# Altium schematic sheet DM3390_CAM_FFC_MIPI_2LANE.SchDoc: =project_title
size Tabloid; PageSetup: Record=PageOptions|CenterHorizontal=True|CenterVertical=True|PrintScale=0.73|XCorrection=1.00|YCorrection=1.00|PrintKind=0|BorderSize=5000000|LeftOffset=0|BottomOffset=0|Orientation=2|PaperLength=1000|PaperWidth=1000|Scale=100|PaperSource=7|PrintQuality=-4|MediaType=1|DitherType=10|PaperKind=A4|PrintScaleMode=1; CompanyName: Luxonis Holding; Organization: Luxonis Holding; Address1: 1925 Harmony Park Drive; Address2: Westminster, CO; Address3: 80234; Address4: United States; SheetNumber: 4; SheetTotal: 12
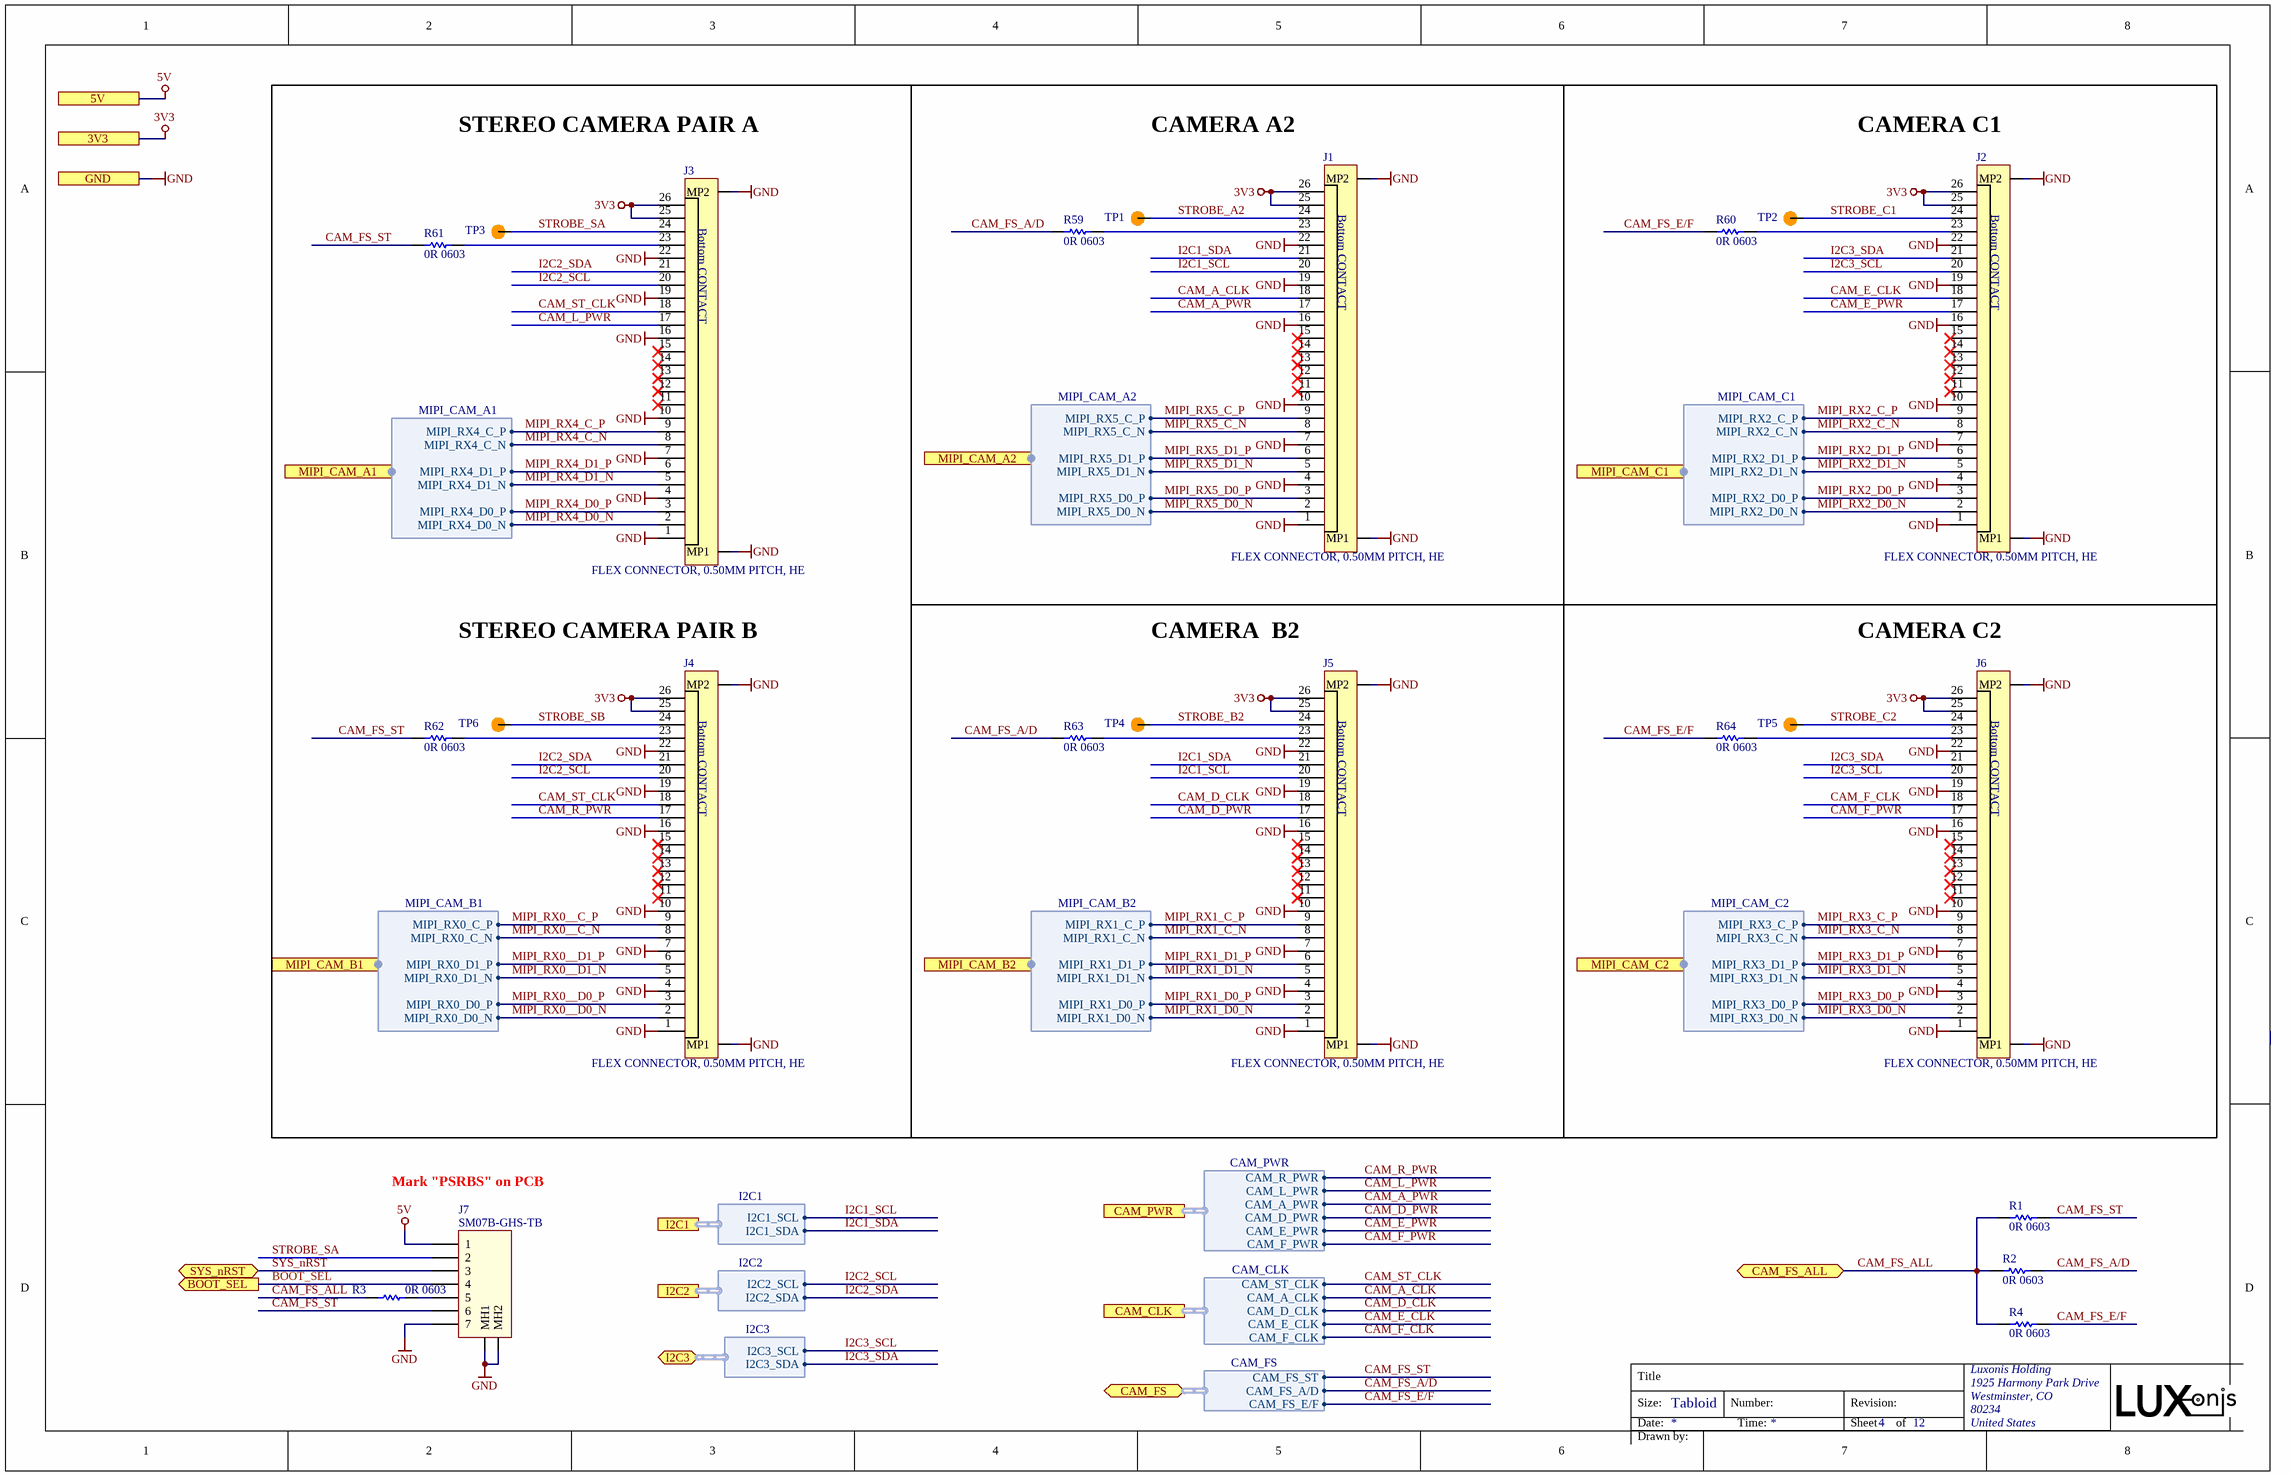
[diagram p0: DM3390_CAM_FFC_MIPI_2LANE.SchDoc]

## Parts
J1  FLEX CONNECTOR, 0.50MM PITCH, HE  [F32R-1A7H1-11026]
J2  FLEX CONNECTOR, 0.50MM PITCH, HE  [F32R-1A7H1-11026]
J3  FLEX CONNECTOR, 0.50MM PITCH, HE  [F32R-1A7H1-11026]
J4  FLEX CONNECTOR, 0.50MM PITCH, HE  [F32R-1A7H1-11026]
J5  FLEX CONNECTOR, 0.50MM PITCH, HE  [F32R-1A7H1-11026]
J6  FLEX CONNECTOR, 0.50MM PITCH, HE  [F32R-1A7H1-11026]
J7  SM07B-GHS-TB  [SM07B-GHS-TB]
R1  0R 0603  [RESC0603(1608)_N]
R2  0R 0603  [RESC0603(1608)_N]
R3  0R 0603  [RESC0603(1608)_N]
R4  0R 0603  [RESC0603(1608)_N]
R59  0R 0603  [RESC0603(1608)_N]
R60  0R 0603  [RESC0603(1608)_N]
R61  0R 0603  [RESC0603(1608)_N]
R62  0R 0603  [RESC0603(1608)_N]
R63  0R 0603  [RESC0603(1608)_N]
R64  0R 0603  [RESC0603(1608)_N]
TP1  TP100_200_NS  [TP100_200_NS]  (value not drawn)  (no BOM)
TP2  TP100_200_NS  [TP100_200_NS]  (value not drawn)  (no BOM)
TP3  TP100_200_NS  [TP100_200_NS]  (value not drawn)  (no BOM)
TP4  TP100_200_NS  [TP100_200_NS]  (value not drawn)  (no BOM)
TP5  TP100_200_NS  [TP100_200_NS]  (value not drawn)  (no BOM)
TP6  TP100_200_NS  [TP100_200_NS]  (value not drawn)  (no BOM)

## Blocks framed on the sheet
CAMERA A2: J1 R59 TP1
CAMERA C1: J2 R60 TP2
CAMERA  B2: J5 R63 TP4
CAMERA C2: J6 R64 TP5

## Ports
3V3, 5V, BOOT_SEL (out), CAM_CLK (harness CAM_CLK), CAM_FS (bidir, harness CAM_FS), CAM_FS_ALL (bidir), CAM_PWR (harness CAM_PWR), GND, I2C1 (harness I2C1), I2C2 (harness I2C2), I2C3 (bidir, harness I2C3), MIPI_CAM_A1 (harness MIPI_CAM_A1), MIPI_CAM_A2 (harness MIPI_CAM_A2), MIPI_CAM_B1 (harness MIPI_CAM_B1), MIPI_CAM_B2 (harness MIPI_CAM_B2), MIPI_CAM_C1 (harness MIPI_CAM_C1), MIPI_CAM_C2 (harness MIPI_CAM_C2), SYS_nRST (bidir)

## Harnesses
MIPI_CAM_C1: MIPI_RX2_D0_P, MIPI_RX2_D0_N, MIPI_RX2_D1_P, MIPI_RX2_D1_N, MIPI_RX2_C_P, MIPI_RX2_C_N
MIPI_CAM_C2: MIPI_RX3_C_P, MIPI_RX3_C_N, MIPI_RX3_D0_N, MIPI_RX3_D0_P, MIPI_RX3_D1_P, MIPI_RX3_D1_N
MIPI_CAM_B2: MIPI_RX1_D1_P, MIPI_RX1_D1_N, MIPI_RX1_C_P, MIPI_RX1_C_N, MIPI_RX1_D0_P, MIPI_RX1_D0_N
MIPI_CAM_B1: MIPI_RX0_D1_P, MIPI_RX0_D1_N, MIPI_RX0_C_P, MIPI_RX0_C_N, MIPI_RX0_D0_P, MIPI_RX0_D0_N
MIPI_CAM_A1: MIPI_RX4_D1_P, MIPI_RX4_D1_N, MIPI_RX4_C_P, MIPI_RX4_C_N, MIPI_RX4_D0_P, MIPI_RX4_D0_N
MIPI_CAM_A2: MIPI_RX5_D1_P, MIPI_RX5_D1_N, MIPI_RX5_C_P, MIPI_RX5_C_N, MIPI_RX5_D0_P, MIPI_RX5_D0_N
CAM_PWR: CAM_R_PWR, CAM_L_PWR, CAM_A_PWR, CAM_D_PWR, CAM_E_PWR, CAM_F_PWR
CAM_CLK: CAM_ST_CLK, CAM_A_CLK, CAM_D_CLK, CAM_E_CLK, CAM_F_CLK
CAM_FS: CAM_FS_ST, CAM_FS_A/D, CAM_FS_E/F
I2C3: I2C3_SCL, I2C3_SDA
I2C2: I2C2_SDA, I2C2_SCL
I2C1: I2C1_SDA, I2C1_SCL

## Nets
3V3: J1.25 J1.26 J2.25 J2.26 J3.25 J3.26 J4.25 J4.26 J5.25 J5.26 J6.25 J6.26 ; port 3V3
5V: J7.1 ; port 5V
GND: J1.1 J1.4 J1.7 J1.10 J1.16 J1.19 J1.22 J1.MP1 J1.MP2 J2.1 J2.4 J2.7 J2.10 J2.16 J2.19 J2.22 J2.MP1 J2.MP2 J3.1 J3.4 J3.7 J3.10 J3.16 J3.19 J3.22 J3.MP1 J3.MP2 J4.1 J4.4 J4.7 J4.10 J4.16 J4.19 J4.22 J4.MP1 J4.MP2 J5.1 J5.4 J5.7 J5.10 J5.16 J5.19 J5.22 J5.MP1 J5.MP2 J6.1 J6.4 J6.7 J6.10 J6.16 J6.19 J6.22 J6.MP1 J6.MP2 J7.7 J7.MH1 J7.MH2 ; port GND
BOOT_SEL: J7.4 ; port BOOT_SEL
CAM_A_CLK: J1.18 ; port CAM_CLK.CAM_A_CLK
CAM_A_PWR: J1.17 ; port CAM_PWR.CAM_A_PWR
CAM_D_CLK: J5.18 ; port CAM_CLK.CAM_D_CLK
CAM_D_PWR: J5.17 ; port CAM_PWR.CAM_D_PWR
CAM_E_CLK: J2.18 ; port CAM_CLK.CAM_E_CLK
CAM_E_PWR: J2.17 ; port CAM_PWR.CAM_E_PWR
CAM_F_CLK: J6.18 ; port CAM_CLK.CAM_F_CLK
CAM_F_PWR: J6.17 ; port CAM_PWR.CAM_F_PWR
CAM_FS_A/D: R2.2 R59.1 R63.1 ; port CAM_FS.CAM_FS_A/D
CAM_FS_ALL: R1.1 R2.1 R3.1 R4.1 ; port CAM_FS_ALL
CAM_FS_E/F: R4.2 R60.1 R64.1 ; port CAM_FS.CAM_FS_E/F
CAM_FS_ST: J7.6 R1.2 R61.1 R62.1 ; port CAM_FS.CAM_FS_ST
CAM_L_PWR: J3.17 ; port CAM_PWR.CAM_L_PWR
CAM_R_PWR: J4.17 ; port CAM_PWR.CAM_R_PWR
CAM_ST_CLK: J3.18 J4.18 ; port CAM_CLK.CAM_ST_CLK
I2C1_SCL: J1.20 J5.20 ; port I2C1.I2C1_SCL
I2C1_SDA: J1.21 J5.21 ; port I2C1.I2C1_SDA
I2C2_SCL: J3.20 J4.20 ; port I2C2.I2C2_SCL
I2C2_SDA: J3.21 J4.21 ; port I2C2.I2C2_SDA
I2C3_SCL: J2.20 J6.20 ; port I2C3.I2C3_SCL
I2C3_SDA: J2.21 J6.21 ; port I2C3.I2C3_SDA
MIPI_RX0__C_N: J4.8 ; port MIPI_CAM_B1.MIPI_RX0_C_N
MIPI_RX0__C_P: J4.9 ; port MIPI_CAM_B1.MIPI_RX0_C_P
MIPI_RX0__D0_N: J4.2 ; port MIPI_CAM_B1.MIPI_RX0_D0_N
MIPI_RX0__D0_P: J4.3 ; port MIPI_CAM_B1.MIPI_RX0_D0_P
MIPI_RX0__D1_N: J4.5 ; port MIPI_CAM_B1.MIPI_RX0_D1_N
MIPI_RX0__D1_P: J4.6 ; port MIPI_CAM_B1.MIPI_RX0_D1_P
MIPI_RX1_C_N: J5.8 ; port MIPI_CAM_B2.MIPI_RX1_C_N
MIPI_RX1_C_P: J5.9 ; port MIPI_CAM_B2.MIPI_RX1_C_P
MIPI_RX1_D0_N: J5.2 ; port MIPI_CAM_B2.MIPI_RX1_D0_N
MIPI_RX1_D0_P: J5.3 ; port MIPI_CAM_B2.MIPI_RX1_D0_P
MIPI_RX1_D1_N: J5.5 ; port MIPI_CAM_B2.MIPI_RX1_D1_N
MIPI_RX1_D1_P: J5.6 ; port MIPI_CAM_B2.MIPI_RX1_D1_P
MIPI_RX2_C_N: J2.8 ; port MIPI_CAM_C1.MIPI_RX2_C_N
MIPI_RX2_C_P: J2.9 ; port MIPI_CAM_C1.MIPI_RX2_C_P
MIPI_RX2_D0_N: J2.2 ; port MIPI_CAM_C1.MIPI_RX2_D0_N
MIPI_RX2_D0_P: J2.3 ; port MIPI_CAM_C1.MIPI_RX2_D0_P
MIPI_RX2_D1_N: J2.5 ; port MIPI_CAM_C1.MIPI_RX2_D1_N
MIPI_RX2_D1_P: J2.6 ; port MIPI_CAM_C1.MIPI_RX2_D1_P
MIPI_RX3_C_N: J6.8 ; port MIPI_CAM_C2.MIPI_RX3_C_N
MIPI_RX3_C_P: J6.9 ; port MIPI_CAM_C2.MIPI_RX3_C_P
MIPI_RX3_D0_N: J6.2 ; port MIPI_CAM_C2.MIPI_RX3_D0_N
MIPI_RX3_D0_P: J6.3 ; port MIPI_CAM_C2.MIPI_RX3_D0_P
MIPI_RX3_D1_N: J6.5 ; port MIPI_CAM_C2.MIPI_RX3_D1_N
MIPI_RX3_D1_P: J6.6 ; port MIPI_CAM_C2.MIPI_RX3_D1_P
MIPI_RX4_C_N: J3.8 ; port MIPI_CAM_A1.MIPI_RX4_C_N
MIPI_RX4_C_P: J3.9 ; port MIPI_CAM_A1.MIPI_RX4_C_P
MIPI_RX4_D0_N: J3.2 ; port MIPI_CAM_A1.MIPI_RX4_D0_N
MIPI_RX4_D0_P: J3.3 ; port MIPI_CAM_A1.MIPI_RX4_D0_P
MIPI_RX4_D1_N: J3.5 ; port MIPI_CAM_A1.MIPI_RX4_D1_N
MIPI_RX4_D1_P: J3.6 ; port MIPI_CAM_A1.MIPI_RX4_D1_P
MIPI_RX5_C_N: J1.8 ; port MIPI_CAM_A2.MIPI_RX5_C_N
MIPI_RX5_C_P: J1.9 ; port MIPI_CAM_A2.MIPI_RX5_C_P
MIPI_RX5_D0_N: J1.2 ; port MIPI_CAM_A2.MIPI_RX5_D0_N
MIPI_RX5_D0_P: J1.3 ; port MIPI_CAM_A2.MIPI_RX5_D0_P
MIPI_RX5_D1_N: J1.5 ; port MIPI_CAM_A2.MIPI_RX5_D1_N
MIPI_RX5_D1_P: J1.6 ; port MIPI_CAM_A2.MIPI_RX5_D1_P
STROBE_A2: J1.24 TP1.1
STROBE_B2: J5.24 TP4.1
STROBE_C1: J2.24 TP2.1
STROBE_C2: J6.24 TP5.1
STROBE_SA: J3.24 J7.2 TP3.1
STROBE_SB: J4.24 TP6.1
SYS_nRST: J7.3 ; port SYS_nRST
NetJ1_23: J1.23 R59.2
NetJ2_23: J2.23 R60.2
NetJ3_23: J3.23 R61.2
NetJ4_23: J4.23 R62.2
NetJ5_23: J5.23 R63.2
NetJ6_23: J6.23 R64.2
NetJ7_5: J7.5 R3.2

Not connected (* = marked no-connect by the designer): J1 11* 12* 13* 14* 15*; J2 11* 12* 13* 14* 15*; J3 11* 12* 13* 14* 15*; J4 11* 12* 13* 14* 15*; J5 11* 12* 13* 14* 15*; J6 11* 12* 13* 14* 15*

## Notes on the sheet
- STEREO CAMERA PAIR A
- (near J4) STEREO CAMERA PAIR B
- Mark "PSRBS" on PCB
- Title
- Size:
- Date:
- Tabloid
- Number:
- Time:
- Revision:
- Sheet
- of
- Drawn by:
- (in symbol F32R-1A7H1-11026) Bottom CONTACT

## Library data of the parts
J1-J6 = F32R-1A7H1-11026: 26 Position FFC, FPC Connector Contacts, Bottom 0.020" (0.50mm) Surface Mount, Right Angle; Manufacturer 1: Amphenol ICC (FCI); Number of Positions: 26; Voltage Rating: 50V; Current Rating: 500mA; Pitch: 0.02inch; Supplier 1: Digi-Key; Manufacturer Part Number 1: F32R-1A7H1-11026; RoHS: Yes; Category: Connectors; Pricing 1: 1=0.77, 10=0.721, 100=0.5529, 500=0.4808 (USD); Mount: Surface Mount; Contact Plating: Tin; Contact Material: Bronze; Min Operating Temperature: -40°C; Max Operating Temperature: 105°C; Packaging: Tape and Reel; Termination: Solder; Flammability Rating: UL94 V-0; ComponentLink1URL: https://cdn.amphenol-icc.com/media/wysiwyg/files/drawing/f32r-f32j.pdf; ComponentLink1Description: https://cdn.amphenol-icc.com/media/wysiwyg/files/drawing/f32r-f32j.pdf; Stock 1: 1709; Supplier Part Number 1: 609-F32R-1A7H1-11026CT-ND
J7 = SM07B-GHS-TB(LF)(SN): Conn Shrouded Header HDR 7 POS 1.25mm Solder RA Side Entry SMD T/R; Manufacturer 1: JST; Connector Type: Outer Shroud Contact; Current Rating: 1A; Voltage Rating (AC): 50V; Number of Positions: 7; Wire/Cable Gauge: 26AWG; Pitch: 0.049inch; Supplier 1: Digi-Key; Manufacturer Part Number 1: SM07B-GHS-TB(LF)(SN); RoHS: Yes; Category: Headers and Wire Housings; Stock 1: 13; Pricing 1: 1=0.55000, 10=0.51400, 100=0.39440, 500=0.34298, 1000=0.28295 (USD); Mount: Surface Mount; Color: Natural; Contact Plating: Tin; Contact Material: Bronze; Housing Material: Nylon; Housing Color: Natural; Min Operating Temperature: -25°C; Max Operating Temperature: 85°C; Number of Rows: 1; Fastening Type: Ramp; Packaging: Cut Tape; Termination: Solder; Number of Contacts: 7; REACH SVHC: Unknown; Lead Free: Lead Free; ComponentLink1URL: https://datasheet.ciiva.com/712/egh-712501.pdf?src-supplier=Digi-Key; ComponentLink1Description: https://datasheet.ciiva.com/712/egh-712501.pdf?src-supplier=Digi-Key; ComponentLink2URL: https://datasheet.ciiva.com/730/egh-730606.pdf?src-supplier=Digi-Key; ComponentLink2Description: https://datasheet.ciiva.com/730/egh-730606.pdf?src-supplier=Digi-Key; ComponentLink3URL: https://datasheet.ciiva.com/22728/5438-22728669.pdf?src-supplier=Element14; ComponentLink3Description: https://datasheet.ciiva.com/22728/5438-22728669.pdf?src-supplier=Element14
R1-R4 R59-R64 = CRCW06030000Z0EA: RES SMD 0 OHM JUMPER 1/10W 0603 0 Ohms Jumper 0.1W, 1/10W Chip Resistor 0603 (1608 Metric) Automotive AEC-Q200 Thick Film; Manufacturer 1: Vishay; Manufacturer Part Number 1: CRCW0603-0000Z0EA; Resistance: 0mR; Power Rating: 100mW; Voltage Rating: 75V; Temperature Coefficient: 100ppm/°C; Tolerance: 5%; Current Rating: 2A; Supplier 1: Digi-Key; Stock 1: 742743; Pricing 1: 1=0.100000, 10=0.034000, 25=0.024400, 50=0.018600, 100=0.013800, 250=0.010480, 500=0.008400, 1000=0.006180 (USD); RoHS: Yes; Mount: Surface Mount; Case/Package: 0603; Weight: 7.1E-05oz; Contact Plating: Tin,Lead; Case Code (Metric): 1608; Case Code (Imperial): 0603; Min Operating Temperature: -55°C; Max Operating Temperature: 155°C; Composition: Thick Film; Termination: SMD/SMT; Packaging: Tape and Reel; Package Quantity: 1; Number of Terminations: 2; Military Standard: Not; Max Power Dissipation: 100mW; Voltage Rating (DC): 75V; Features: Automotive AEC-Q200; Working Voltage: 75V; Length: 1.55mm; Height: 0.02inch; Width: 0.033inch; Depth: 0.85mm; Radiation Hardening: No; Lead Free: Lead Free; REACH SVHC: Unknown; ComponentLink1URL: https://datasheet.ciiva.com/2461/dcrcwe3-2461968.pdf?src-supplier=Digi-Key; ComponentLink1Description: https://datasheet.ciiva.com/2461/dcrcwe3-2461968.pdf?src-supplier=Digi-Key; ComponentLink2URL: https://datasheet.ciiva.com/2461/dcrcwe3-2461969.pdf?src-supplier=Digi-Key; ComponentLink2Description: https://datasheet.ciiva.com/2461/dcrcwe3-2461969.pdf?src-supplier=Digi-Key; ComponentLink3URL: https://datasheet.ciiva.com/2461/dcrcwe3-2461970.pdf?src-supplier=Digi-Key; ComponentLink3Description: https://datasheet.ciiva.com/2461/dcrcwe3-2461970.pdf?src-supplier=Digi-Key; ComponentLink4URL: https://datasheet.ciiva.com/8340/dcrcwe3-8340197.pdf?src-supplier=Avnet; ComponentLink4Description: https://datasheet.ciiva.com/8340/dcrcwe3-8340197.pdf?src-supplier=Avnet; ComponentLink5URL: https://datasheet.ciiva.com/16941/dcrcw-16941302.pdf?src-supplier=Avnet+Europe; ComponentLink5Description: https://datasheet.ciiva.com/16941/dcrcw-16941302.pdf?src-supplier=Avnet+Europe; ComponentLink6URL: https://datasheet.ciiva.com/16199/dcrcwe3-16199063.pdf?src-supplier=Future+Electronics; ComponentLink6Description: https://datasheet.ciiva.com/16199/dcrcwe3-16199063.pdf?src-supplier=Future+Electronics; ComponentLink7URL: https://datasheet.ciiva.com/16725/70201119-16725175.pdf?src-supplier=Allied+Electronics; ComponentLink7Description: https://datasheet.ciiva.com/16725/70201119-16725175.pdf?src-supplier=Allied+Electronics; ComponentLink8URL: https://datasheet.ciiva.com/26316/fld-crcw-e3-data-en-26316615.pdf?src-supplier=Distrelec; ComponentLink8Description: https://datasheet.ciiva.com/26316/fld-crcw-e3-data-en-26316615.pdf?src-supplier=Distrelec; ComponentLink9URL: https://datasheet.ciiva.com/5544/dcrcwe3-109170-5544344.pdf?src-supplier=Mouser; ComponentLink9Description: https://datasheet.ciiva.com/5544/dcrcwe3-109170-5544344.pdf?src-supplier=Mouser; ComponentLink10URL: https://datasheet.ciiva.com/7841/1720486-7841816.pdf?src-supplier=Element14; ComponentLink10Description: https://datasheet.ciiva.com/7841/1720486-7841816.pdf?src-supplier=Element14; ComponentLink11URL: https://datasheet.ciiva.com/7841/1720486-7841817.pdf?src-supplier=Element14; ComponentLink11Description: https://datasheet.ciiva.com/7841/1720486-7841817.pdf?src-supplier=Element14; ComponentLink12URL: https://datasheet.ciiva.com/7841/125364-7841818.pdf?src-supplier=Element14; ComponentLink12Description: https://datasheet.ciiva.com/7841/125364-7841818.pdf?src-supplier=Element14; ComponentLink13URL: https://datasheet.ciiva.com/16721/70201119-16721450.pdf?src-supplier=Allied+Electronics; ComponentLink13Description: https://datasheet.ciiva.com/16721/70201119-16721450.pdf?src-supplier=Allied+Electronics; Supplier Part Number 1: 541-0.0GCT-ND
TP1-TP6 = TEST_POINT